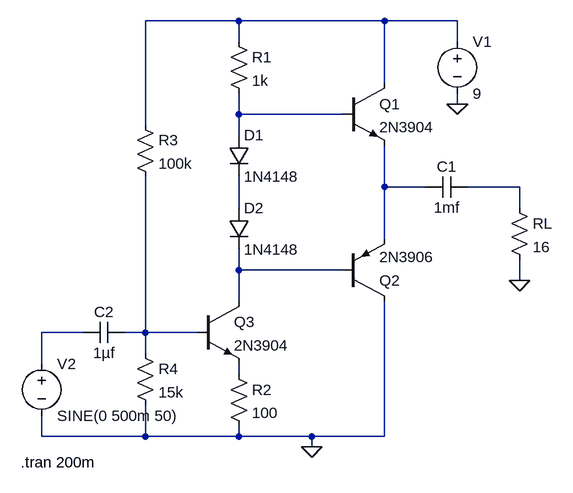
[diagram p0: schematic project_classAB_amp.asc]
project_classAB_amp.asc, the LTspice schematic file:
Version 4.1
SHEET 1 880 696
WIRE 32 0 -112 0
WIRE 256 0 32 0
WIRE 368 0 256 0
WIRE 32 32 32 0
WIRE 368 32 368 0
WIRE 256 96 256 0
WIRE 368 128 368 112
WIRE 32 144 32 112
WIRE 192 144 32 144
WIRE -112 160 -112 0
WIRE 32 176 32 144
WIRE 256 256 256 192
WIRE 320 256 256 256
WIRE 464 256 384 256
WIRE 32 288 32 240
WIRE 464 288 464 256
WIRE 256 336 256 256
WIRE 32 384 32 352
WIRE 192 384 32 384
WIRE 464 400 464 368
WIRE 32 432 32 384
WIRE -208 480 -272 480
WIRE -112 480 -112 240
WIRE -112 480 -144 480
WIRE -32 480 -112 480
WIRE -112 512 -112 480
WIRE -272 528 -272 480
WIRE 32 544 32 528
WIRE -272 640 -272 608
WIRE -112 640 -112 592
WIRE -112 640 -272 640
WIRE 32 640 32 624
WIRE 32 640 -112 640
WIRE 144 640 32 640
WIRE 256 640 256 432
WIRE 256 640 144 640
WIRE 144 656 144 640
FLAG 464 400 0
FLAG 368 128 0
FLAG 144 656 0
SYMBOL npn 192 96 R0
SYMATTR InstName Q1
SYMATTR Value 2N3904
SYMBOL pnp 192 432 M180
SYMATTR InstName Q2
SYMATTR Value 2N3906
SYMBOL cap 384 240 R90
WINDOW 0 0 32 VBottom 2
WINDOW 3 32 32 VTop 2
SYMATTR InstName C1
SYMATTR Value 1mf
SYMBOL res 448 272 R0
SYMATTR InstName RL
SYMATTR Value 16
SYMBOL voltage 368 16 R0
WINDOW 123 0 0 Left 0
WINDOW 39 0 0 Left 0
SYMATTR InstName V1
SYMATTR Value 9
SYMBOL diode 16 176 R0
SYMATTR InstName D1
SYMATTR Value 1N4148
SYMBOL diode 16 288 R0
SYMATTR InstName D2
SYMATTR Value 1N4148
SYMBOL res 16 16 R0
SYMATTR InstName R1
SYMATTR Value 1k
SYMBOL npn -32 432 R0
SYMATTR InstName Q3
SYMATTR Value 2N3904
SYMBOL res 16 528 R0
SYMATTR InstName R2
SYMATTR Value 100
SYMBOL res -128 144 R0
SYMATTR InstName R3
SYMATTR Value 100k
SYMBOL cap -144 464 R90
WINDOW 0 0 32 VBottom 2
WINDOW 3 32 32 VTop 2
SYMATTR InstName C2
SYMATTR Value 1µf
SYMBOL voltage -272 512 R0
WINDOW 123 0 0 Left 0
WINDOW 39 0 0 Left 0
SYMATTR InstName V2
SYMATTR Value SINE(0 500m 50)
SYMBOL res -128 496 R0
SYMATTR InstName R4
SYMATTR Value 15k
TEXT -304 680 Left 2 !.tran 200m

The netlist it stands for:
* project_classAB_amp.asc
Q1 N001 N002 N003 0 2N3904
Q2 0 N006 N003 0 2N3906
C1 N004 N003 1mf
RL N004 0 16
V1 N001 0 9
D1 N002 N005 1N4148
D2 N005 N006 1N4148
R1 N001 N002 1k
Q3 N006 N008 N009 0 2N3904
R2 N009 0 100
R3 N001 N008 100k
C2 N008 N007 1µf
V2 N007 0 SINE(0 500m 50)
R4 N008 0 15k
.model D D
.lib standard.dio
.model NPN NPN
.model PNP PNP
.lib standard.bjt
.tran 200m
.backanno
.end